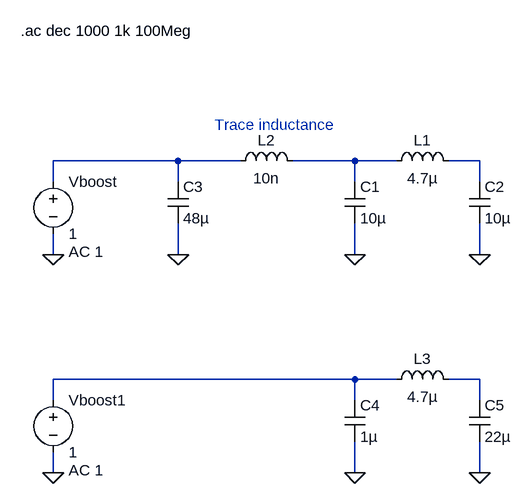
[diagram p0: schematic Power_Supply_Filters.asc]
Power_Supply_Filters.asc, the LTspice schematic file:
Version 4
SHEET 1 880 680
WIRE -224 80 -416 80
WIRE -128 80 -224 80
WIRE 48 80 -48 80
WIRE 112 80 48 80
WIRE 240 80 192 80
WIRE -416 112 -416 80
WIRE -224 112 -224 80
WIRE 48 112 48 80
WIRE 240 112 240 80
WIRE -416 224 -416 192
WIRE -224 224 -224 176
WIRE 48 224 48 176
WIRE 240 224 240 176
WIRE 48 416 -416 416
WIRE 112 416 48 416
WIRE 240 416 192 416
WIRE -416 448 -416 416
WIRE 48 448 48 416
WIRE 240 448 240 416
WIRE -416 560 -416 528
WIRE 48 560 48 512
WIRE 240 560 240 512
FLAG 48 224 0
FLAG 240 224 0
FLAG -416 224 0
FLAG -224 224 0
FLAG 48 560 0
FLAG 240 560 0
FLAG -416 560 0
SYMBOL cap 32 112 R0
SYMATTR InstName C1
SYMATTR Value 10µ
SYMBOL cap 224 112 R0
SYMATTR InstName C2
SYMATTR Value 10µ
SYMBOL ind 96 96 R270
WINDOW 0 32 56 VTop 2
WINDOW 3 5 56 VBottom 2
SYMATTR InstName L1
SYMATTR Value 4.7µ
SYMBOL voltage -416 96 R0
WINDOW 123 24 124 Left 2
WINDOW 39 0 0 Left 0
SYMATTR InstName Vboost
SYMATTR Value 1
SYMATTR Value2 AC 1
SYMBOL cap -240 112 R0
SYMATTR InstName C3
SYMATTR Value 48µ
SYMBOL ind -144 96 R270
WINDOW 0 32 56 VTop 2
WINDOW 3 5 56 VBottom 2
SYMATTR InstName L2
SYMATTR Value 10n
SYMBOL cap 32 448 R0
SYMATTR InstName C4
SYMATTR Value 1µ
SYMBOL cap 224 448 R0
SYMATTR InstName C5
SYMATTR Value 22µ
SYMBOL ind 96 432 R270
WINDOW 0 32 56 VTop 2
WINDOW 3 5 56 VBottom 2
SYMATTR InstName L3
SYMATTR Value 4.7µ
SYMBOL voltage -416 432 R0
WINDOW 123 24 124 Left 2
WINDOW 39 0 0 Left 0
SYMATTR InstName Vboost1
SYMATTR Value 1
SYMATTR Value2 AC 1
TEXT -466 -120 Left 2 !.ac dec 1000 1k 100Meg
TEXT -168 24 Left 2 ;Trace inductance

The netlist it stands for:
* Power_Supply_Filters.asc
C1 N002 0 10µ
C2 N003 0 10µ
L1 N002 N003 4.7µ
Vboost N001 0 1 AC 1
C3 N001 0 48µ
L2 N001 N002 10n
C4 N004 0 1µ
C5 N005 0 22µ
L3 N004 N005 4.7µ
Vboost1 N004 0 1 AC 1
.ac dec 1000 1k 100Meg
* Trace inductance
.backanno
.end